# Altium schematic sheet TTP.SchDoc: Mu
size A4; SheetNumber: 1; SheetTotal: 1
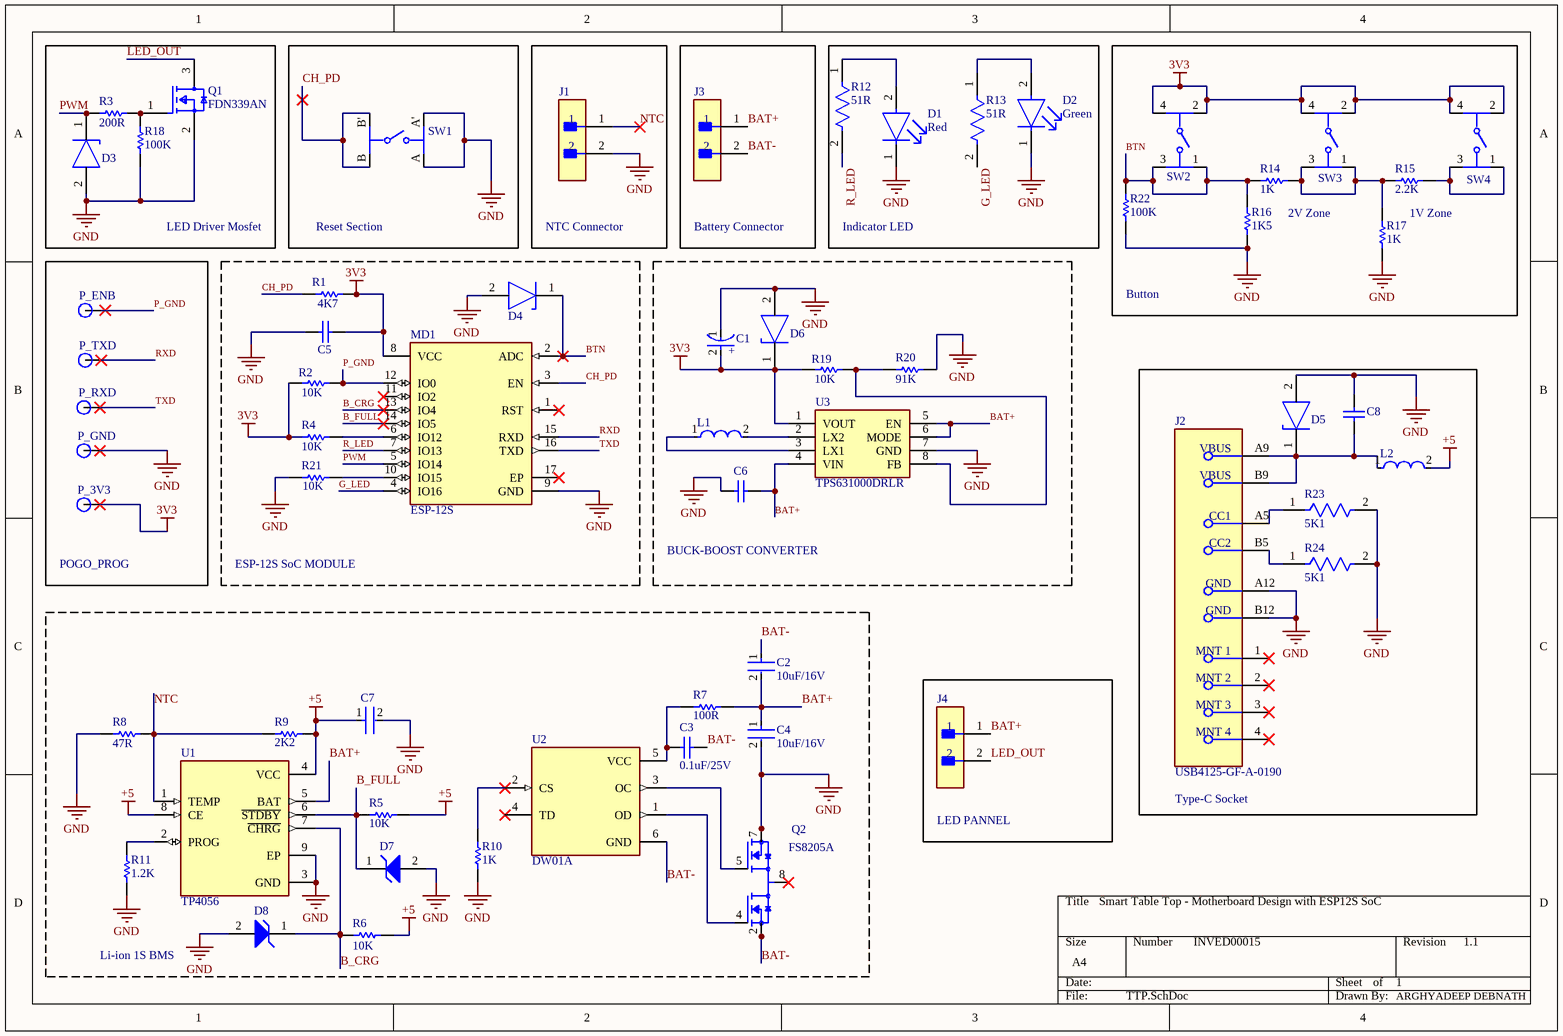
[diagram p0: TTP.SchDoc]

## Parts
C1  TAJC476K020RNJ  [FP-TAJC-MFG]  (value not drawn)
C2  10uF/16V  [FP-C1206C-EH-MFG]
C3  0.1uF/25V  [CAPC1608X92X38ML15T08]
C4  10uF/16V  [FP-C1206C-EH-MFG]
C5  1uF/16V  [CAPC1206(3216)170_L]  (value not drawn)
C6  1uF/16V  [CAPC1206(3216)170_L]  (value not drawn)
C7  1uF/25V  [FP-1206-L_3_2_0_2-W_1_6_0-IPC_B]  (value not drawn)
C8  CAP 1uF 10V 1210(3225)  [CAPC1210(3225)170_N]  (value not drawn)
D1  Red  [FP-SML-LX0603IW-TR-MFG]
D2  Green  [FP-SML-LX0603IW-TR-MFG]
D3  PTVS3V3P1UP,115  [FP-SOD128-MFG]  (value not drawn)
D4  PTVS3V3P1UP,115  [FP-SOD128-MFG]  (value not drawn)
D5  PTVS3V3P1UP,115  [FP-SOD128-MFG]  (value not drawn)
D6  PTVS3V3P1UP,115  [FP-SOD128-MFG]  (value not drawn)
D7  SZMMSZ5222BT1G  [ONSC-SOD-123-2-425-04_V]  (value not drawn)
D8  SZMMSZ5222BT1G  [ONSC-SOD-123-2-425-04_V]  (value not drawn)
J1  B2B-XH-A(LF)(SN)  [FP-B2B-XH-A_LF_SN-MFG]  (value not drawn)
J2  USB4125-GF-A-0190  [FP-USB4125-GF-A-0190-MFG]
J3  B2B-XH-A(LF)(SN)  [FP-B2B-XH-A_LF_SN-MFG]  (value not drawn)
J4  B2B-XH-A(LF)(SN)  [FP-B2B-XH-A_LF_SN-MFG]  (value not drawn)
L1  DFE252012F-1R0M=P2  [FP-DFE252012C-IPC_C]  (value not drawn)
L2  NRS5030T4R7MMGJ  [FP-NRS5030-H_3_1-MFG]  (value not drawn)
MD1  ESP-12S  [FP-ESP-12S-MFG]
P_3V3  TP_1mm  [TP_1mm]  (value not drawn)
P_ENB  TP_1mm  [TP_1mm]  (value not drawn)
P_GND  TP_1mm  [TP_1mm]  (value not drawn)
P_RXD  TP_1mm  [TP_1mm]  (value not drawn)
P_TXD  TP_1mm  [TP_1mm]  (value not drawn)
Q1  FDN339AN  [FP-527AG-MFG]
Q2  FS8205A  [SOP65P640X120-8N]
R1  value 4K7  [RESC3116X65N]  (hidden comment: Resistor)
R2  value 10K  [RESC3116X65N]  (hidden comment: Resistor)
R3  value 200R  [RESC3116X65N]  (hidden comment: Resistor)
R4  value 10K  [RESC3116X65N]  (hidden comment: Resistor)
R5  value 10K  [RESC3116X65N]  (hidden comment: Resistor)
R6  value 10K  [RESC3116X65N]  (hidden comment: Resistor)
R7  value 100R  [RESC3116X65N]  (hidden comment: Resistor)
R8  value 47R  [RESC3116X65N]  (hidden comment: Resistor)
R9  value 2K2  [RESC3116X65N]  (hidden comment: Resistor)
R10  value 1K  [RESC3116X65N]  (hidden comment: Resistor)
R11  value 1.2K  [RESC3116X65N]  (hidden comment: Resistor)
R12  51R  [FP-CR1206-IPC_C]
R13  51R  [FP-CR1206-IPC_C]
R14  value 1K  [RESC3116X65N]  (hidden comment: Resistor)
R15  value 2.2K  [RESC3116X65N]  (hidden comment: Resistor)
R16  value 1K5  [RESC3116X65N]  (hidden comment: Resistor)
R17  value 1K  [RESC3116X65N]  (hidden comment: Resistor)
R18  value 100K  [RESC3116X65N]  (hidden comment: Resistor)
R19  value 10K  [RESC3116X65N]  (hidden comment: Resistor)
R20  91K  [RESC2013X60X30ML20T20]
R21  value 10K  [RESC3116X65N]  (hidden comment: Resistor)
R22  value 100K  [RESC3116X65N]  (hidden comment: Resistor)
R23  5K1  [FP-ESR18-IPC_A]
R24  5K1  [FP-ESR18-IPC_A]
SW1  EVP-AYG0BA  [FP-EVP-AYG0BA-MFG]  (value not drawn)
SW2  EVQ-3P202K  [FP-EVQ-3P202K-MFG]  (value not drawn)
SW3  EVQ-3P202K  [FP-EVQ-3P202K-MFG]  (value not drawn)
SW4  EVQ-3P202K  [FP-EVQ-3P202K-MFG]  (value not drawn)
U1  TP4056  [SOP127P600X175-9N]
U2  DW01A  [SOT95P280X145-6N]
U3  TPS631000DRLR  [SOTFL50P160X60-8N]

## Blocks framed on the sheet
LED Driver Mosfet: D3 Q1 R3 R18
NTC Connector: J1
Battery Connector: J3
Indicator LED: D1 D2 R12 R13
POGO_PROG: P_3V3 P_ENB P_GND P_RXD P_TXD
ESP-12S SoC MODULE: C5 D4 MD1 R1 R2 R4 R21
BUCK-BOOST CONVERTER: C1 C6 D6 L1 R19 R20 U3
Type-C Socket: C8 D5 J2 L2 R23 R24
Li-ion 1S BMS: C2-C4 C7 D7 D8 Q2 R5-R11 U1 U2
LED PANNEL: J4

## Nets
3V3: C1.2(A) C5.1 D6.1(C) MD1.8(VCC) P_3V3.1 R1.1 R2.2 R4.2 R19.2 SW2.2 SW2.4 SW3.2 SW3.4 SW4.2 SW4.4 U3.1(VOUT)
+5: C7.1 L2.2 R5.1 R6.1 R9.1 U1.4(VCC) U1.8(CE)
GND: C1.1(C) C4.2 C5.2 C6.1 C7.2 C8.2 D1.1(C) D2.1(C) D3.2(A) D4.2(A) D5.2(A) D6.2(A) D7.2(A) D8.2(A) J1.2 J2.A12(GND) J2.B12(GND) MD1.9(GND) P_GND.1 Q1.2(S) Q2.6(S2) Q2.7(S2) R8.2 R10.2 R11.2 R16.2 R17.2 R18.2 R20.2 R21.2 R22.2 R23.2 R24.2 SW1.A SW1.A' U1.3(GND) U1.9(EP) U3.7(GND)
B_CRG: D8.1(K) MD1.13(IO4) R6.2 U1.7(~{CHRG})
B_FULL: D7.1(K) MD1.14(IO5) R5.2 U1.6(~{STDBY})
BAT+: C2.2 C4.1 C6.2 J3.1 J4.1 R7.1 U1.5(BAT) U3.4(VIN) U3.5(EN) U3.6(MODE)
BAT-: C2.1 C3.2 J3.2 Q2.2(S1) Q2.3(S1) U2.6(GND)
BTN: D4.1(C) MD1.2(ADC) R14.2 R16.1 R22.1 SW2.1 SW2.3
CH_PD: MD1.3(EN) R1.2 SW1.B SW1.B'
G_LED: MD1.4(IO16) R13.2
LED_OUT: J4.2 Q1.3(D)
NTC: J1.1 R8.1 R9.2 U1.1(TEMP)
P_GND: MD1.12(IO0) P_ENB.1 R2.1
PWM: D3.1(C) MD1.5(IO14) R3.2
R_LED: MD1.7(IO13) R12.2
RXD: MD1.15(RXD) P_TXD.1
TXD: MD1.16(TXD) P_RXD.1
NetC3_1: C3.1 R7.2 U2.5(VCC)
NetC8_1: C8.1 D5.1(C) J2.A9(VBUS) J2.B9(VBUS) L2.1
NetD1_2: D1.2(A) R12.1
NetD2_2: D2.2(A) R13.1
NetJ2_A5: J2.A5(CC1) R23.1
NetJ2_B5: J2.B5(CC2) R24.1
NetL1_1: L1.1 U3.3(LX1)
NetL1_2: L1.2 U3.2(LX2)
NetMD1_6: MD1.6(IO12) R4.1
NetMD1_10: MD1.10(IO15) R21.1
NetQ1_1: Q1.1(G) R3.1 R18.1
NetQ2_1: Q2.1(D12) Q2.8(D12)
NetQ2_4: Q2.4(G1) U2.1(OD)
NetQ2_5: Q2.5(G2) U2.3(OC)
NetR10_1: R10.1 U2.2(CS)
NetR11_1: R11.1 U1.2(PROG)
NetR14_1: R14.1 R15.2 R17.1 SW3.1 SW3.3
NetR15_1: R15.1 SW4.1 SW4.3
NetR19_1: R19.1 R20.1 U3.8(FB)

Not connected (* = marked no-connect by the designer): J2 1(MNT_1)* 2(MNT_2)* 3(MNT_3)* 4(MNT_4)*; MD1 1(RST)* 11(IO2)* 17(EP)*; U2 4(TD)*

## Notes on the sheet
- Reset Section
- 2V Zone
- 1V Zone
- Button
- Smart Table Top - Motherboard Design with ESP12S SoC
- INVED00015
- 1
- 1.1
- ARGHYADEEP DEBNATH
- (in symbol CMP-04424-000153-1) +

## Library data of the parts
C1 = CMP-04424-000153-1: 47uF 20V  ±10% 500mΩ 2312  SMD Tantalum Capacitor; Leakage Current: 9.4uA; Polarity: Polar; Dissipation Factor: 6%; ESR (Equivalent Series Resistance): 500mR; Voltage Rating (DC): 20V; Series: TAJ; Lead Pitch: 2.9mm; Case/Package: Molded; Packaging: Tape and Reel; Case Code (Imperial): 2312; Depth: 3.2mm; Mount: Surface Mount; Height: 2.6mm; Dielectric Material: Tantalum; Capacitance: 47uF; Height - Seated (Max): 0.11inch; REACH SVHC: No SVHC; Voltage Rating: 20V; RoHS Compliant: Yes; Case Code (Metric): 6032; Max Operating Temperature: 125°C; Package Quantity: 1; Lead Free: Lead Free; Voltage: 20V; Construction: Flat; Min Operating Temperature: -55°C; Features: General Purpose; Termination: SMD/SMT; Number of Pins: 2; Length: 6mm; Tolerance: 10%; Radiation Hardening: No; Width: 0.126inch
C2 C4 = CMP-03020-003375-1: CAP CER 10UF 16V X7R 1206; Manufacturer Part Number: C1206C106K4RACAUTO; Manufacturer: Kemet; Material: Ceramic; Temperature Coefficient: 15%; Tolerance: 10%; Automotive Grade: Grade 1; Digikey Description: CAP CER 10UF 16V X7R 1206; RoHS: TRUE; Temperature Range Low: -55°C; Ipc Land Pattern Name: CAPC320160X160; Category: Cap; Mouser Description: Multilayer Ceramic Capacitors MLCC - SMD/SMT 10uF 16V 10% AUTO; Device Class L1: Passive Components; Automotive: Yes; ComponentLink2Description: Datasheet; Octopart: https://octopart.com/c1206c106k4racauto-kemet-20072893; Package: C1206C-EH; Temperature: -55°C to +125°C; Device Class L3: Ceramic Capacitors; Device Class L2: Capacitors; Temperature Range High: +125°C; Capacitance: 10uF; Value: 10uF; Lead Free: Yes; Height: 1.8mm; Temperature Characteristic: X7R; ComponentLink2URL: https://content.kemet.com/datasheets/KEM_C1023_X7R_AUTO_SMD.pdf; Voltage Rating: 16V
C3 = CMP-2006-01140-1: Part Number: VJ0603Y104MXXAC; Manufacturer: Vitramon
C5 C6 = CMP-1037-04687-1: CAP 1uF 16V ±10% 1206 (3216 Metric) Thickness 1.7mm SMD; Case-EIA: 1206; Tolerance: Â±10%; Case-Metric: 3216; Rated Voltage: 16 V; Max Thickness: 1.7 mm; Technology: SMT; Value: 1uF
C7 = CMP-04427-010925-1: Automotive Ceramic Capacitor, 1206, 1uF, 5%, X7R, 15%, 50V; Mount: Surface Mount; Min Operating Temperature: -55°C; Voltage Rating (DC): 50V; Ratings: AEC-Q200; Tolerance: 5%; RoHS Compliant: Yes; Max Operating Temperature: 125°C; Width: 0.063inch; Voltage Rating: 50V; Thickness: 0.037inch; Package Quantity: 2000; Capacitance: 1uF; Packaging: Tape and Reel; Length: 0.126inch; Case/Package: 1206; Dielectric: X7R
C8 = CMP-1038-02006-2: CAP 1uF 10V ±20% 1210 (3225 Metric) Thickness 1.7mm SMD; Case-EIA: 1210; Tolerance: Â±20%; Case-Metric: 3225; Max Thickness: 1.7 mm; Technology: SMT; Rated Voltage: 10 V; Value: 1uF
D1 D2 = CMP-57192-000012-1: LED RED DIFFUSED SMD; Luminous Intensity: 14mcd; Test Current: 20mA; Viewing Angle: 160°; Approvals: UL; Forward Voltage: 2V; Power Dissipation: 50mW; Dominant Wavelength: 635nm; Number of LEDs: 1; Lens Color: White; Height: 0.6mm; RoHS Compliant: Yes; Lead Free: Lead Free; Number of Pins: 2; Packaging: Tape and Reel; Case/Package: 0603; Length: 1.6mm; Color: Red; Max Operating Temperature: 85°C; Illumination Color: Red; Case Code (Metric): 1608; Diameter: 0.061inch; Min Operating Temperature: -25°C; Lens Style: Diffused; Mount: Surface Mount; Width: 0.8mm; Case Code (Imperial): 0603; Lens Transparency: Diffused; Wavelength: 635nm; Package Quantity: 1; Forward Current: 20mA
D3-D6 = CMP-14436-000013-1: TVS DIODE 3.3V 8V CFP5; RoHS Compliant: Yes
D7 D8 = CMP-1060-00443-1: Zener Voltage Regulator, 500 mW, 2-Pin SOD-123, Pb-Free, Tape and Reel; Manufacturer: On Semiconductor; VZ Typ (V): 2.5; P Max (W): 0.5; ComponentLink2Description: Datasheet; DatasheetVersion: Rev. 12; ComponentLink1URL: http://www.onsemi.com/; PartNumber: SZMMSZ5222BT1G; PackageDescription: 2-Pin SOD, Body 1.6 x 2.69 mm; Mounting Technology: Surface Mount; ComponentLink3URL: http://www.onsemi.com/pub_link/Collateral/425-04.PDF; RoHS: Pb-Free; ComponentLink3Description: Package Specification; PackageReference: SOD-123-2-425-04; ComponentLink2URL: http://www.onsemi.cn/pub_link/Collateral/MMSZ5221BT1-D.PDF; PackageVersion: Rev. G, 10/2009; ComponentLink1Description: Manufacturer URL; Packing: Tape and Reel
J1 J3 J4 = CMP-2000-05888-3: CONN HEADER VERT 2POS 2.5MM; Current Rating: 3A; Voltage Rating: 250V; Number of Contacts: 2; Contact Resistance: 20mR; Wire/Cable Gauge: 22AWG; Insulation Resistance: 1GR; Connector Type: Male Pin; Packaging: Bulk; Contact Material: Brass; Lead Free: Lead Free; Orientation: Straight; Contact Plating: Tin; Max Current Rating: 3A; Termination: Solder; Fastening Type: Detent; Depth: 5.75mm; Housing Material: Polyamide; REACH SVHC: No SVHC; Series: XH; Voltage Rating (AC): 250V; Number of Positions: 2; Color: Natural; Contact Type: Male Pin; Max Voltage Rating (DC): 250V; Pitch: 2.5mm; Lead Pitch: 2.5mm; Mount: Through Hole; Max Operating Temperature: 85°C; Length: 7.4mm; Max Voltage Rating (AC): 250V; Min Operating Temperature: -25°C; Number of Rows: 1; Housing Color: White
J2 = CMP-245163-000004-1: CONN RCPT TYPE C 6P SMD RA
L1 = CMP-06042-000286-1: Shielded Wirewound Inductor 1uH 20% 3300mA 0.04Ω 1008 (2520); Saturation Current: 5.3A; Current Rating: 3.3A; DC Resistance (DCR): 40mR; Test Frequency: 1MHz; Core Material: Ferrite; Case Code (Imperial): 1008; Width: 0.079inch; Inductance: 1uH; Case Code (Metric): 2520; Packaging: Tape and Reel; Length: 0.098inch; Mount: Surface Mount; Tolerance: 20%; Height - Seated (Max): 0.047inch; Shielding: Shielded; Min Operating Temperature: -40°C; Case/Package: 1008; Max Operating Temperature: 125°C
L2 = CMP-14484-001108-1: Inductor Power Shielded Wirewound 4.7uH 20% 100KHz Ferrite 2.6A 45.5mΩ DCR T/R; DC Resistance (DCR): 35mR; Saturation Current: 3.1A; Self Resonant Frequency: 31MHz; Max Operating Temperature: 125°C; Min Operating Temperature: -25°C; Tolerance: 20%; Mount: Surface Mount; Current Rating: 2.6A; Length: 4.9mm; Inductance: 4.7uH; Termination: SMD/SMT; Packaging: Tape and Reel; Height: 3.1mm; Core Material: Ferrite; Package Quantity: 500; Width: 0.193inch; Case/Package: 5030; Height - Seated (Max): 0.122inch; Radiation Hardening: No; Shielding: Shielded; RoHS Compliant: Yes; Depth: 4.9mm; Max DC Current: 3.1A; Halogen Free: Halogen Free; Test Frequency: 100kHz
MD1 = CMP-204316-000002-1: RX TXRX MOD WIFI PCB TRACE SMD; Interface: I2C; Sensitivity: -90dBm; Data Rate: 54Mbps; Frequency: 2.484GHz; Series: -
P_3V3 P_ENB P_GND P_RXD P_TXD = TP_1mm: Test Point 1 mm dia pad type
Q1 = CMP-2000-06252-2: MOSFET N-CH 20V 3A SSOT3; Nominal Vgs: 850mV; Drain to Source Resistance: 29mR; Rds On Max: 35mR; Rise Time: 10ns; Gate to Source Voltage (Vgs): 8V; Element Configuration: Single; Number of Elements: 1; Input Capacitance: 700pF; Power Dissipation: 500mW; Turn-On Delay Time: 8ns; Turn-Off Delay Time: 18ns; Termination: SMD/SMT; Mount: Surface Mount; Radiation Hardening: No; Max Operating Temperature: 150°C; Drain to Source Voltage (Vdss): 20V; Continuous Drain Current (ID): 3A; REACH SVHC: No SVHC; Current Rating: 3A; Packaging: Tape and Reel; Case/Package: TO-236-3; On-State Resistance: 35mR; Number of Pins: 3; Threshold Voltage: 850mV; Width: 1.4mm; Height: 0.94mm; Fall Time: 10ns; Voltage Rating (DC): 20V; Length: 2.92mm; Package Quantity: 1; Weight: 0.03g; Min Operating Temperature: -55°C; Drain to Source Breakdown Voltage: 20V; Lead Free: Lead Free; Max Power Dissipation: 500mW; Dual Supply Voltage: 20V
Q2 = FS8205A: MF: Fortune Semiconductor; SnapEDA_Link: https://www.snapeda.com/parts/FS8205A/Fortune+Semiconductor/view-part/?ref=snap; Package: Package; Value: *; MP: FS8205A; Check_prices: https://www.snapeda.com/parts/FS8205A/Fortune+Semiconductor/view-part/?ref=eda
R1-R11 R14-R19 R21 R22 = Resistor: TC1: 0; SimulationGenericComponent: True; TC2: 0
R12 R13 = CMP-07231-007316-1: Thick Film Chip Resistors 1206 51Ω 0.25W 1% 100ppm/°C; Power Rating: 250mW; Voltage Rating: 200V; RoHS Compliant: Yes; Case Code (Metric): 3216; Construction: Rectangular; Packaging: Tape and Reel; Length: 3.2mm; Max Operating Temperature: 155°C; Depth: 1.6mm; Tolerance: 1%; Radiation Hardening: No; Package Quantity: 5000; Contact Plating: Tin; Mount: Surface Mount; Series: CR1206; Military Standard: Not; Features: Moisture Resistant; Thickness: 610um; Termination: SMD/SMT; Resistance: 51R; Temperature Coefficient: 100ppm/°C; Case/Package: 1206; Case Code (Imperial): 1206; Min Operating Temperature: -55°C; Number of Terminations: 2; Resistor Type: Thick Film; Width: 1.6mm; Max Power Dissipation: 250mW; Height: 0.6mm
R20 = CMP-2001-01863-1: Part Number: RK73B2ATTD913J; Manufacturer: KOA Speer
R23 R24 = CMP-08839-028234-1: 5.1kΩ ±1% 0.5W 1206 Anti-Surge Chip Resistor AEC-Q200; Temperature Coefficient: 100ppm/°C; Max Power Dissipation: 333mW; Resistance: 5.1kR; Resistor Type: Thick Film; Max Operating Temperature: 155°C; Min Operating Temperature: -55°C; Features: Automotive AEC-Q200; Height: 0.026inch; Length: 0.126inch; Packaging: Tape and Reel; Width: 0.063inch; Case/Package: 1206; Tolerance: 1%; Series: ESR18; Number of Terminations: 2; RoHS Compliant: Yes; Package Quantity: 5000
SW1 = CMP-05618-000108-1: SWITCH TACTILE SPST-NO 0.02A 15V; Actuator Type: Standard; Illumination Type: Non-Illuminated; Operating Force: 240gf; Switch Function: Off-Mom; Mechanical Life: 500000Cycles; Throw Configuration: SPST; Switch Travel: 0.15mm; Packaging: Tape and Reel; Max Operating Temperature: 85°C; Min Operating Temperature: -40°C; Mount: Surface Mount
SW2-SW4 = CMP-05618-000079-1: SWITCH TACTILE SPST-NO 0.02A 15V; Current Rating: 20mA; Actuator Color: Black; Actuator Type: Standard; Electrical Life: 200000Cycles; Actuator Length: 0.85mm; Switch Function: Off-Mom; Throw Configuration: SPST; Contact Resistance: 100mR; Switch Travel: 0.7mm; Operating Force: 5N; Illumination Type: Non-Illuminated; Max Voltage Rating (DC): 15V; Termination: J-Bend; Orientation: Straight; Min Operating Temperature: -40°C; Depth: 5.5mm; Size: 3.5mm; Max Operating Temperature: 85°C; Case/Package: SMD/SMT; Radiation Hardening: No; Voltage Rating (DC): 15V; Series: EVQ3P2; Packaging: Tape and Reel; Length: 3.5mm; Max Current Rating: 20mA; Lead Free: Lead Free; Mechanical Life: 200000Cycles; Mount: Surface Mount; Package Quantity: 4000
U1 = TP4056: Complete single cell Li-Ion battery with a constant current / constant voltage linear charger; MF: NanJing Top Power ASIC Corp.; Check_prices: https://www.snapeda.com/parts/TP4056/NanJing+Top+Power+ASIC+Corp./view-part/?ref=eda; SnapEDA_Link: https://www.snapeda.com/parts/TP4056/NanJing+Top+Power+ASIC+Corp./view-part/?ref=snap; Price: None; Availability: Not in stock; Package: Package; MP: TP4056; Value: *
U2 = DW01A: One Cell Lithium-ion/Polymer Battery Protection IC; MF: Fortune Semiconductor; SnapEDA_Link: https://www.snapeda.com/parts/DW01A/Fortune+Semiconductor/view-part/?ref=snap; Package: SOT-23-6 Fortune Semiconductor; Value: *; MP: DW01A; Check_prices: https://www.snapeda.com/parts/DW01A/Fortune+Semiconductor/view-part/?ref=eda
U3 = TPS631000DRLR: Switching Voltage Regulators 1.5-A output current, high power density buck-boost converter; Manufacturer_Name: Texas Instruments; Geometry.Height: 0.6mm; Manufacturer_Part_Number: TPS631000DRLR; Mouser Part Number: 595-TPS631000DRLR; Mouser Price/Stock: https://www.mouser.co.uk/ProductDetail/Texas-Instruments/TPS631000DRLR?qs=rSMjJ%252B1ewcRYwoN2deTeNA%3D%3D; Arrow Part Number: TPS631000DRLR; Arrow Price/Stock: https://www.arrow.com/en/products/tps631000drlr/texas-instruments?utm_currency=USD&region=nac; Datasheet Link: https://www.ti.com/lit/ds/symlink/tps631000.pdf?ts=1652152702265